# EAGLE design pm2v (EAGLE 4.16)
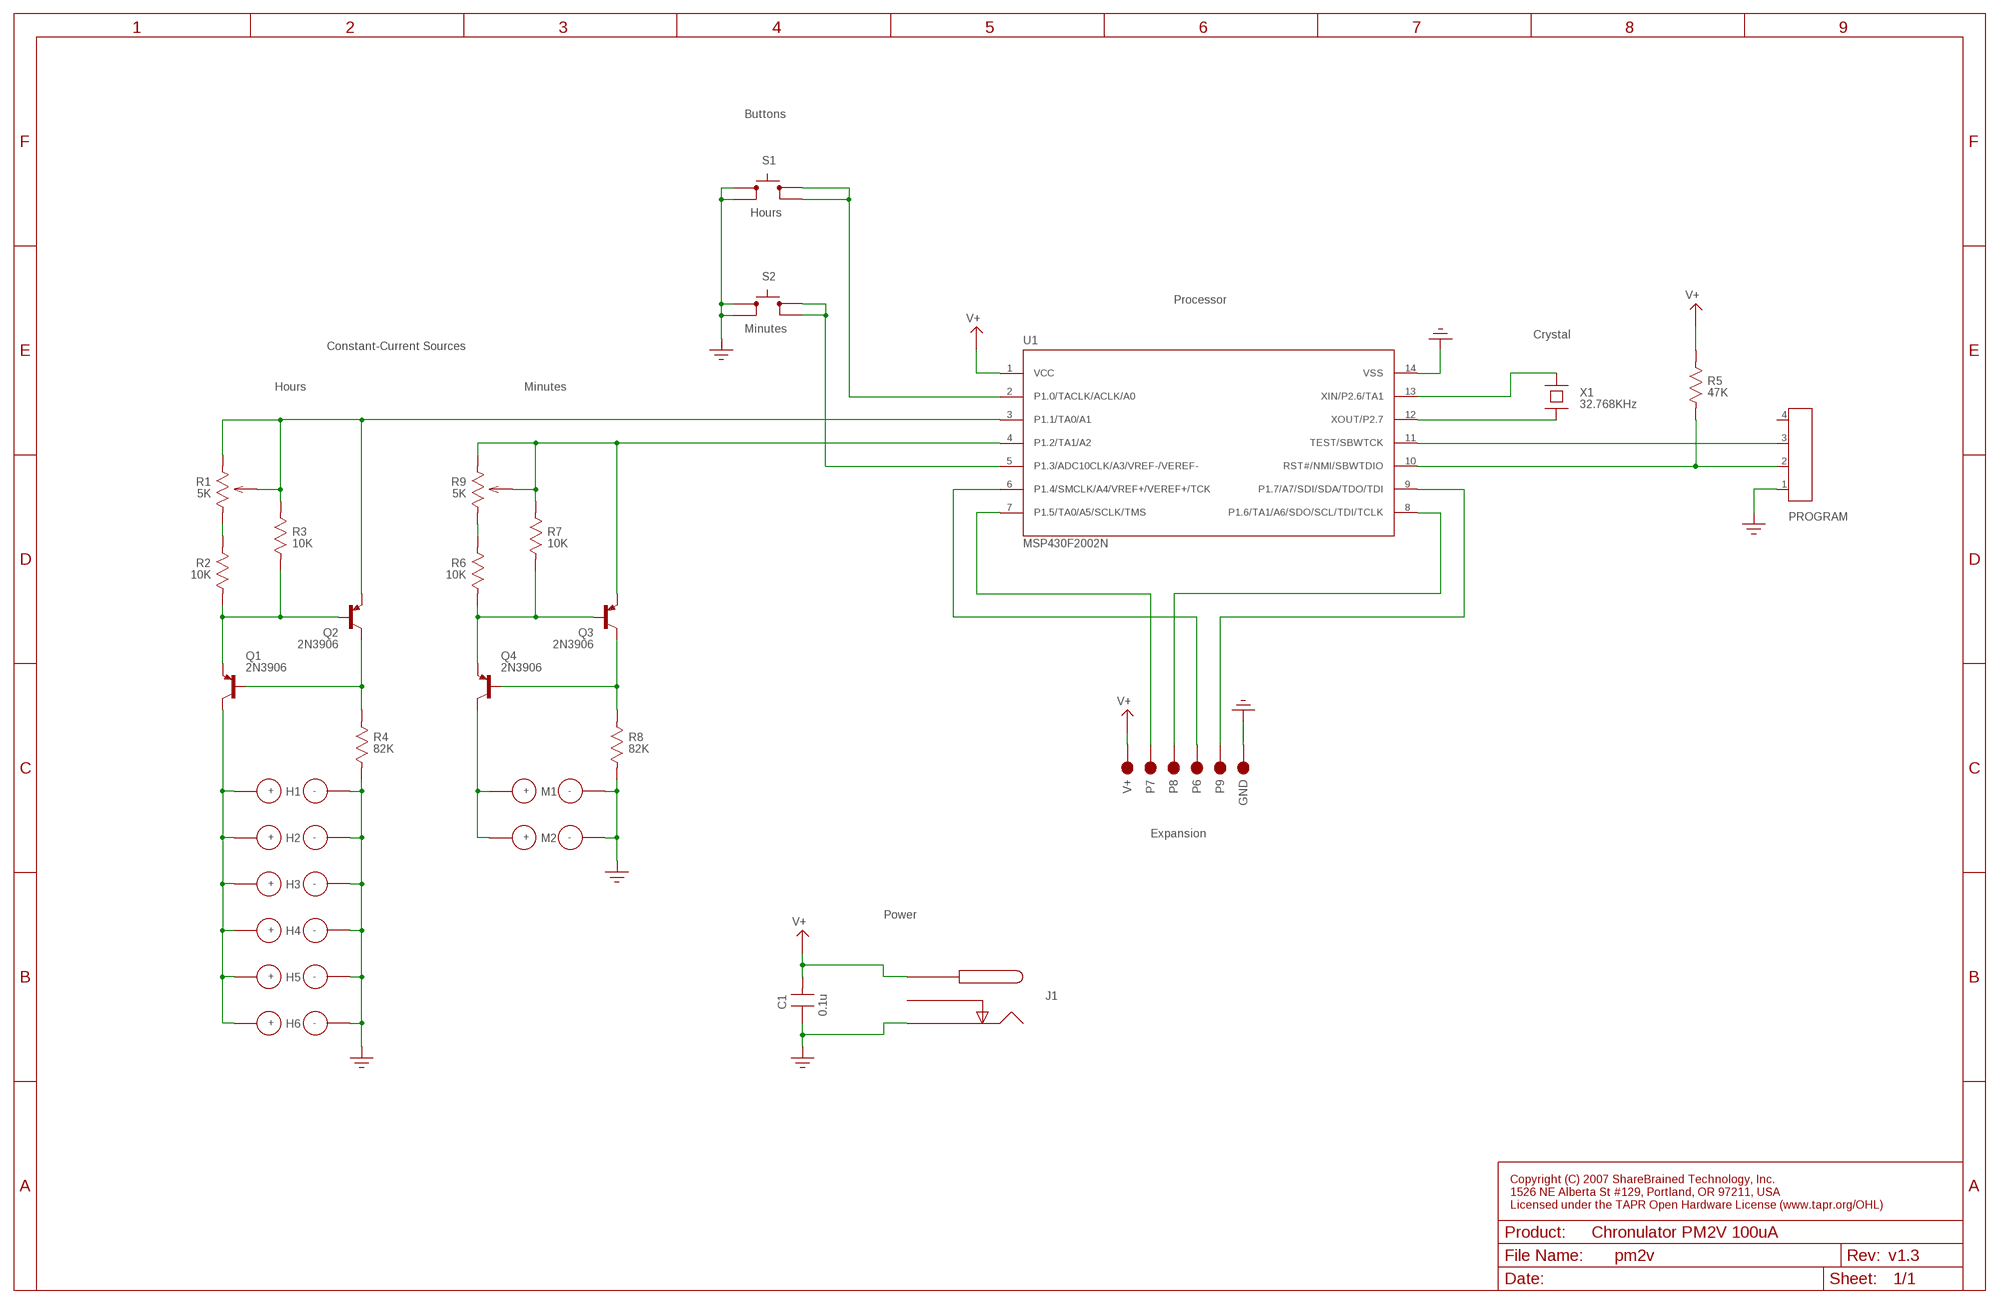
[diagram p0: schematic, sheet 1]

## Parts
C1  0.1u  CEPCOS_B37987F-EZ  [EPCOS_B37987F-EZ]
GND  GND  TPHOLE035-EZ  [HOLE035-EZ]
H1  METER_FOOTPRINTGME_PM89  [GME_PM89]
H2  METER_FOOTPRINTGME_PM89  [GME_PM89]
H3  METER_FOOTPRINTGME_PM89  [GME_PM89]
H4  METER_FOOTPRINTGME_PM89  [GME_PM89]
H5  METER_FOOTPRINTGME_PM89  [GME_PM89]
H6  METER_FOOTPRINTGME_PM89  [GME_PM89]
J1  CUI_PJ-007CUI_PJ-007-EZ  [CUI_PJ-007-EZ]
LABEL1  Chronulator PM2V 100uA  VALUEVALUE  [VALUE]
M1  METER_FOOTPRINTGME_PM89  [GME_PM89]
M2  METER_FOOTPRINTGME_PM89  [GME_PM89]
P6  P6  TPHOLE035-EZ  [HOLE035-EZ]
P7  P7  TPHOLE035-EZ  [HOLE035-EZ]
P8  P8  TPHOLE035-EZ  [HOLE035-EZ]
P9  P9  TPHOLE035-EZ  [HOLE035-EZ]
PRODUCT_REV  v1.3  VALUEVALUE  [VALUE]
PROGRAM  CON4  [MILL_MAX-851-XX-004-20-001000]
Q1  2N3906  2N3906TO92-EZ  [TO92-EZ]
Q2  2N3906  2N3906TO92-EZ  [TO92-EZ]
Q3  2N3906  2N3906TO92-EZ  [TO92-EZ]
Q4  2N3906  2N3906TO92-EZ  [TO92-EZ]
R1  5K  RPANASONIC_EVUE[23]A-EZ  [PANASONIC_EVUE[23]A-EZ]
R2  10K  RRES6324X28-EZ  [RES6324X28-EZ]
R3  10K  RRES6324X28-EZ  [RES6324X28-EZ]
R4  82K  RRES6324X28-EZ  [RES6324X28-EZ]
R5  47K  RRES6324X28-EZ  [RES6324X28-EZ]
R6  10K  RRES6324X28-EZ  [RES6324X28-EZ]
R7  10K  RRES6324X28-EZ  [RES6324X28-EZ]
R8  82K  RRES6324X28-EZ  [RES6324X28-EZ]
R9  5K  RPANASONIC_EVUE[23]A-EZ  [PANASONIC_EVUE[23]A-EZ]
S1  S2CK_PTS645S-EZ  [CK_PTS645S-EZ]
S2  S2CK_PTS645S-EZ  [CK_PTS645S-EZ]
U1  MSP430F2002N  [DIL14]
V+  V+  TPHOLE035-EZ  [HOLE035-EZ]
X1  32.768KHz  X_EPSON_C-001R-EZ  [C-001R-EZ]

## Nets
GND: C1.1 GND.P$1 H1.- H2.- H3.- H4.- H5.- H6.- J1.2 M1.- M2.- PROGRAM.1 R4.P$1 R8.P$1 S1.1 S1.2 S2.1 S2.2 U1.14(VSS)
N$1: U1.12(XOUT/P2.7) X1.1
N$2: U1.13(XIN/P2.6/TA1) X1.2
N$3: Q3.2(B) Q4.3(E) R6.P$1 R7.P$1
N$4: M1.+ M2.+ Q4.1(C)
N$5: PROGRAM.3 U1.11(TEST/SBWTCK)
N$6: Q3.1(C) Q4.2(B) R8.P$2
N$7: P7.P$1 U1.7(P1.5/TA0/A5/SCLK/TMS)
N$8: PROGRAM.2 R5.P$1 U1.10(RST#/NMI/SBWTDIO)
N$9: S1.3 S1.4 U1.2(P1.0/TACLK/ACLK/A0)
N$10: S2.3 S2.4 U1.5(P1.3/ADC10CLK/A3/VREF-/VEREF-)
N$11: Q1.3(E) Q2.2(B) R2.P$1 R3.P$1
N$12: H1.+ H2.+ H3.+ H4.+ H5.+ H6.+ Q1.1(C)
N$13: P6.P$1 U1.6(P1.4/SMCLK/A4/VREF+/VEREF+/TCK)
N$14: P8.P$1 U1.8(P1.6/TA1/A6/SDO/SCL/TDI/TCLK)
N$15: P9.P$1 U1.9(P1.7/A7/SDI/SDA/TDO/TDI)
N$17: Q2.3(E) R1.2 R1.3 R3.P$2 U1.3(P1.1/TA0/A1)
N$18: Q3.3(E) R7.P$2 R9.2 R9.3 U1.4(P1.2/TA1/A2)
N$19: Q1.2(B) Q2.1(C) R4.P$2
N$21: R1.1 R2.P$2
N$22: R6.P$2 R9.1
V+: C1.2 J1.1 R5.P$2 U1.1(VCC) V+.P$1
Unconnected: J1.3 PROGRAM.4

## Notes on the sheet
- Buttons
- Hours
- Processor
- Minutes
- Crystal
- Constant-Current Sources
- Hours | Minutes
- Expansion
- Power

## Library data of the parts
C1 = capacitors_th:C
GND P6-P9 V+ = test:TP
H1-H6 M1 M2 = meters:METER_FOOTPRINT
J1 = dc_jack:CUI_PJ-007
LABEL1 PRODUCT_REV = pcb:VALUE
PROGRAM = connectors_th:CON4
Q1-Q4 = transistors_th:2N3906: PNP Transistor
R1 R9 = potentiometers:R
R2-R8 = resistors_th:R
S1 S2 = switches_th:S2
U1 = TI:MSP430F2002
X1 = crystals_th:X

## Net classes
0 default: width 0.508 mm, drill 0.305 mm, clearance 0.508 mm

## Board
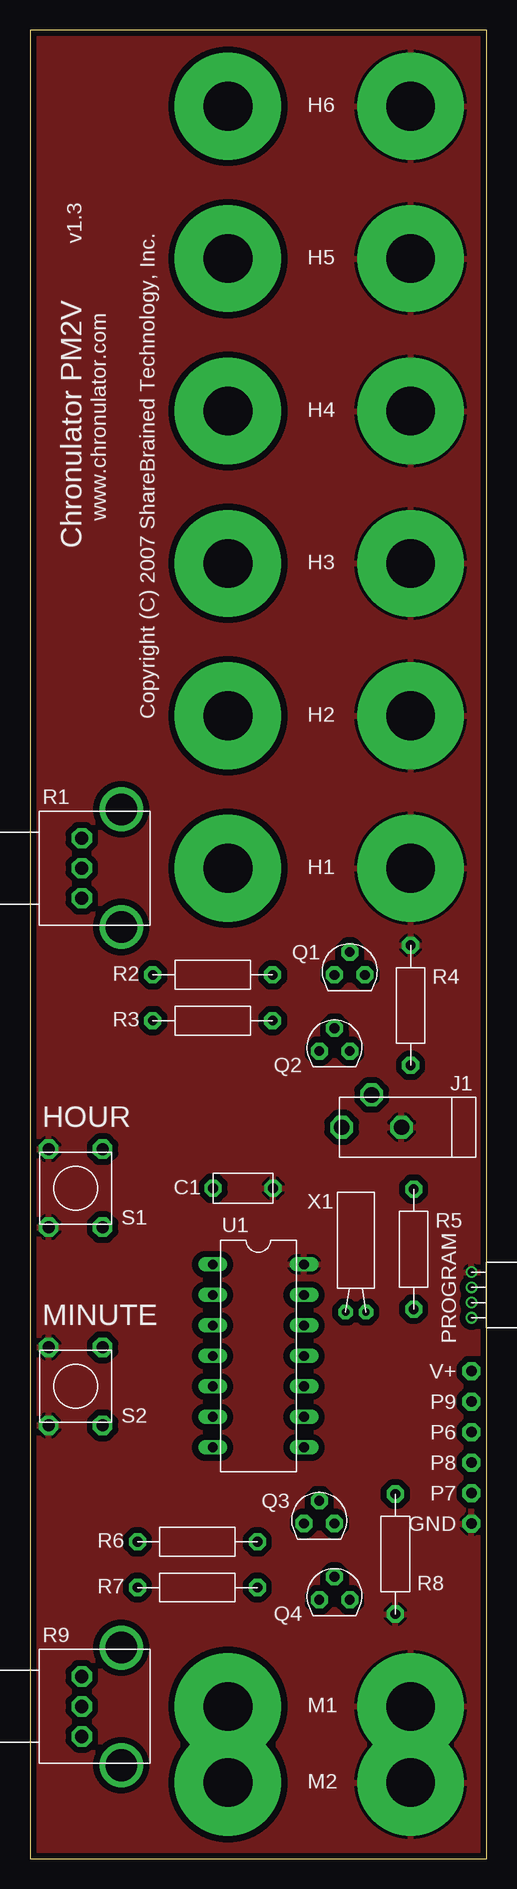
[diagram p1: board, top side]
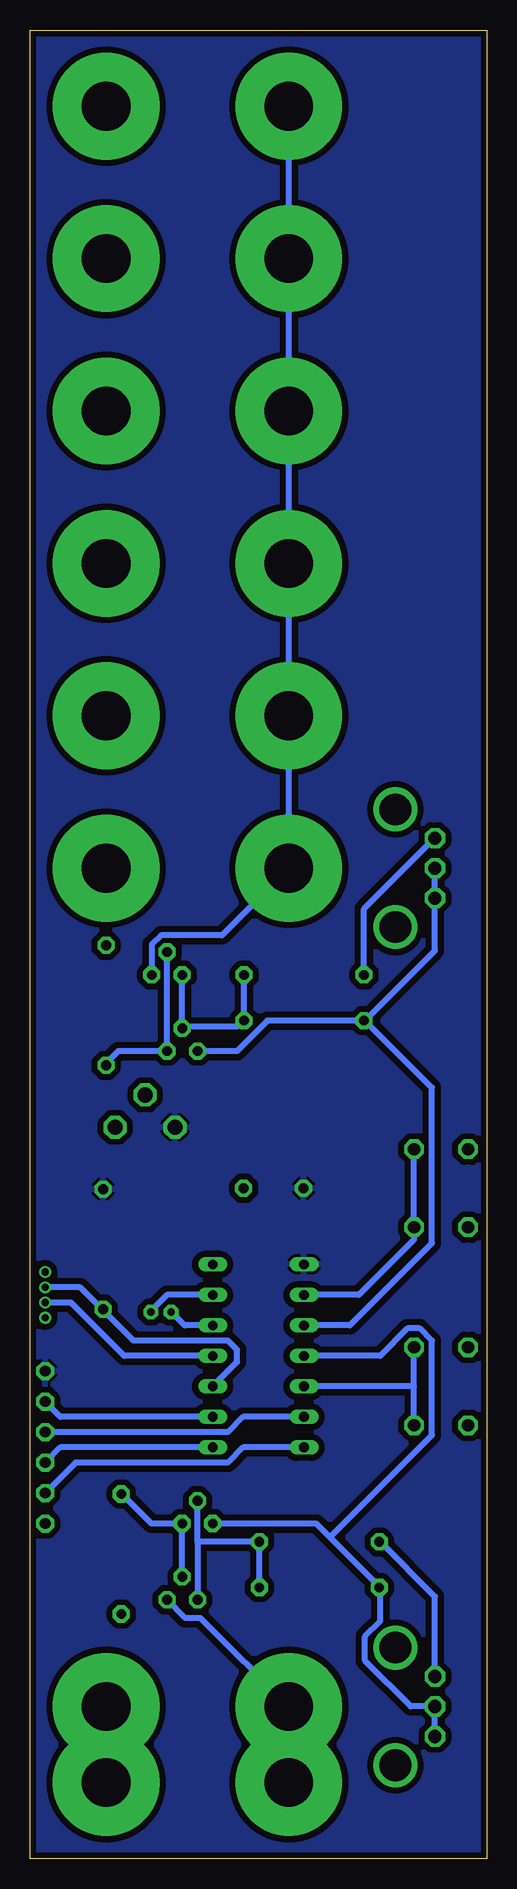
[diagram p2: board, bottom side, seen from below]

Size 38.1 x 152.4 mm. Coordinates in mm from the lower left corner, seen from the top.
Outline: 0,152.4 0,0 38.1,0 38.1,152.4 0,152.4
Copper layers (1*16): Top 0.035mm / dielectric 1.5mm / Bottom 0.035mm
Design rules "pm2v": minimum track width 6mil, minimum drill 15mil, track to track 8mil, track to pad 8mil, pad to pad 8mil, via to via 8mil, smd to smd 8mil, copper to edge 20mil, drill to drill 20mil, minimum pad ring 7mil, minimum via ring 5mil, stop-mask expansion 3mil, vias tented up to drill 0mil, thermal gap 10mil

### Footprints (pad centres in the part's own frame; a part is rotated, then mirrored left to right if it is on the bottom)
EPCOS_B37987F-EZ = drill 0.813 pad 1.422 octagon: 1 -2.5,0; 2 2.5,0
HOLE035-EZ = drill 0.889 pad 1.499 octagon: P$1 0,0
GME_PM89 = drill 4.064 pad 8.89 round: + -7.62,0; - 7.62,0
CUI_PJ-007-EZ = drill 1.27 octagon: 1 5.5,0; 2 0.5,0; 3 3,-2.7
MILL_MAX-851-XX-004-20-001000 = drill 0.61 round: 1 0,1.905; 2 0,0.635; 3 0,-0.635; 4 0,-1.905
TO92-EZ = drill 0.813 pad 1.422 octagon: 1 1.27,0; 2 0,1.905; 3 -1.27,0
PANASONIC_EVUE[23]A-EZ = drill 1.1 pad 1.7 octagon: 1 -2.5,-3.3; 2 0,-3.3; 3 2.5,-3.3 | drill 2.64 round: X -4.9,0; X' 4.9,0
RES6324X28-EZ = drill 0.813 pad 1.422 octagon: P$1 -5,0; P$2 5,0
CK_PTS645S-EZ = drill 1.016 pad 1.626 octagon: 1 3.25,2.25; 2 -3.25,2.25; 3 3.25,-2.25; 4 -3.25,-2.25
DIL14 = drill 0.813 long: 1 -7.62,-3.81; 2 -5.08,-3.81; 3 -2.54,-3.81; 4 0,-3.81; 5 2.54,-3.81; 6 5.08,-3.81; 7 7.62,-3.81; 8 7.62,3.81; 9 5.08,3.81; 10 2.54,3.81; 11 0,3.81; 12 -2.54,3.81; 13 -5.08,3.81; 14 -7.62,3.81
C-001R-EZ = drill 0.61 pad 1.219 octagon: 1 -0.85,-6; 2 0.85,-6

### Placement (x,y rotation side)
C1  17.78,55.88 180 top
GND  36.83,27.94 180 top
H1  24.13,82.55 0 top
H2  24.13,95.25 0 top
H3  24.13,107.95 0 top
H4  24.13,120.65 0 top
H5  24.13,133.35 0 top
H6  24.13,146.05 0 top
J1  31.5,60.96 180 top
LABEL1  Chronulator PM2V  [VALUE]  2.29,109.22 90 top
M1  24.13,12.7 0 top
M2  24.13,6.35 0 top
P6  36.83,35.56 180 top
P7  36.83,30.48 180 top
P8  36.83,33.02 180 top
P9  36.83,38.1 180 top
PRODUCT_REV  4.32,134.62 90 top
PROGRAM  36.83,46.99 0 top
Q1  26.67,73.66 0 top
Q2  25.4,67.31 0 top
Q3  24.13,27.94 0 top
Q4  25.4,21.59 0 top
R1  10K  [PANASONIC_EVUE[23]A-EZ]  7.62,82.55 270 top
R2  18K  [RES6324X28-EZ]  15.24,73.66 180 top
R3  18K  [RES6324X28-EZ]  15.24,69.85 180 top
R4  100K  [RES6324X28-EZ]  31.75,71.12 270 top
R5  32,50.8 90 top
R6  18K  [RES6324X28-EZ]  13.97,26.42 180 top
R7  18K  [RES6324X28-EZ]  13.97,22.61 180 top
R8  100K  [RES6324X28-EZ]  30.48,25.4 90 top
R9  10K  [PANASONIC_EVUE[23]A-EZ]  7.62,12.7 270 top
S1  3.81,55.88 90 top
S2  3.81,39.37 90 top
U1  19.05,41.91 270 top
V+  36.83,40.64 180 top
X1  27.18,51.56 0 top

### Tracks (layer width: path | path; a pad name or v marks a point on that pad's centre or on a via)
GND
  pour Top: 0,0 0,152.4 38.1,152.4 38.1,0
N$1
  Bottom 0.508: X1.1 26.31,45.57 25.2,44.45 U1.12
N$2
  Bottom 0.508: X1.2 28.03,45.63 26.67,46.99 U1.13
N$3
  Bottom 0.508: 24.13,26.42 Q4.3 | 24.13,26.42 Q3.2 | 24.13,26.42 R6.P$1 18.97,22.69 19.05,22.61 R7.P$1
N$4
  Bottom 0.508: M2.+ M1.+ 23.88,20.07 25.15,20.07 Q4.1
N$5
  Bottom 0.508: U1.11 30.23,41.91 34.67,46.35 36.7,46.35 36.83,46.23 PROGRAM.3
N$6
  Bottom 0.508: Q4.2 Q3.1 27.94,27.94 30.4,30.4 R8.P$2
N$7
  Bottom 0.508: U1.7 20.32,34.29 21.59,33.02 34.29,33.02 P7.P$1
N$8
  Bottom 0.508: U1.10 20.83,41.4 20.83,42.42 21.59,43.18 29.46,43.18 32,45.72 R5.P$1 32.08,45.8 33.91,47.62 36.7,47.62 36.83,47.5 PROGRAM.2
N$9
  Bottom 0.508: S1.4 6.06,52.61 6.1,52.58 | S1.4 S1.3 | S1.4 6.06,51.6 10.67,46.99 U1.2
N$10
  Bottom 0.508: S2.4 6.06,39.37 | 6.06,39.37 S2.3 | 6.06,39.37 U1.5
N$11
  Bottom 0.508: 25.4,69.34 Q2.2 | 25.4,69.34 Q1.3 | R2.P$1 20.32,73.66 20.24,73.58 20.24,69.93 20.32,69.85 | 25.4,69.34 20.83,69.34 20.32,69.85 | R3.P$1 20.32,69.85
N$12
  Bottom 0.508: Q1.1 27.94,76.2 27.18,76.96 22.1,76.96 H1.+ H2.+ H3.+ H4.+ H5.+ H6.+
N$13
  Bottom 0.508: U1.6 20.32,36.83 21.59,35.56 P6.P$1
N$14
  Bottom 0.508: U1.8 35.56,34.29 P8.P$1
N$15
  Bottom 0.508: U1.9 35.56,36.83 P9.P$1
N$17
  Bottom 0.508: Q2.3 20.83,67.31 18.29,69.85 R3.P$2 10.16,69.85 | R1.3 4.32,80.01 | R1.3 R1.2 | R1.3 4.32,75.69 10.16,69.85 | U1.3 11.43,44.45 4.57,51.31 4.57,64.26 10.16,69.85
N$18
  Bottom 0.508: 8.97,22.94 R7.P$2 8.89,22.61 | R9.3 R9.2 6.35,12.7 10.16,16.51 10.16,18.54 8.89,19.81 8.89,22.61 | Q3.3 14.22,27.94 13.08,26.8 | U1.4 8.89,41.91 6.6,44.2 5.59,44.2 4.57,43.18 4.57,35.31 13.08,26.8 | 8.89,22.61 13.08,26.8
N$19
  Bottom 0.508: Q1.2 Q2.1 30.73,67.31 31.75,66.29 R4.P$2
N$21
  Bottom 0.508: R1.1 4.36,85.05 10.24,79.17 R2.P$2
N$22
  Bottom 0.508: R6.P$2 8.89,26.42 4.32,21.84 4.32,15.24 R9.1
V+
  pour Bottom: 0,152.4 38.1,152.4 38.1,0 0,0

### Text on the board
tPlace: www.chronulator.com | Copyright (C) 2007 ShareBrained Technology, Inc.
tNames: HOUR | MINUTE